# Altium schematic sheet PowerboardV2Sheet2.SchDoc
size A; SheetNumber: 2; SheetTotal: 2
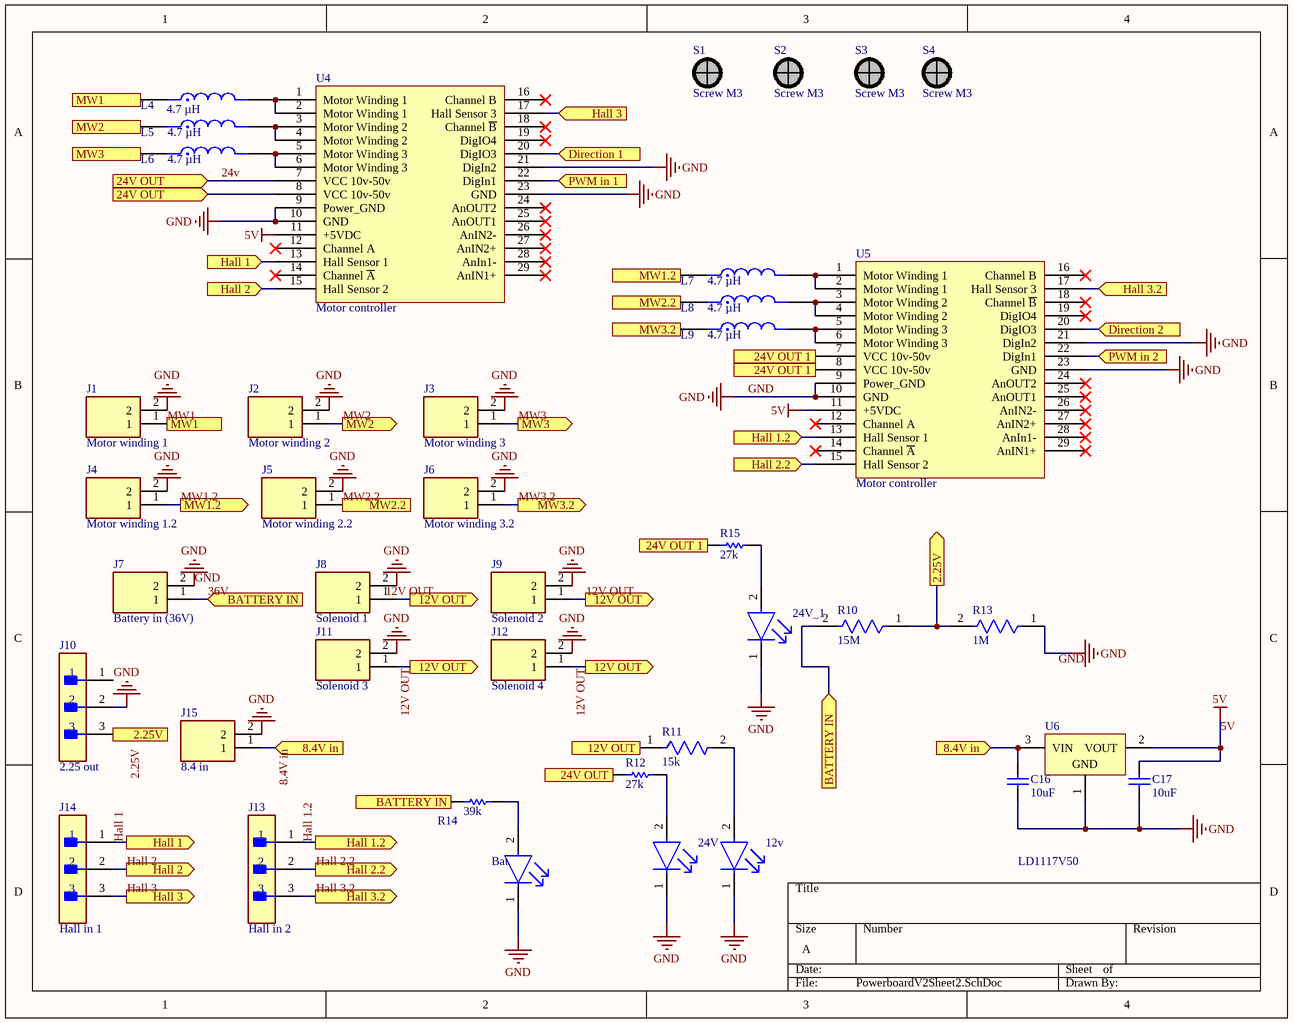
[diagram p0: PowerboardV2Sheet2.SchDoc]

## Parts
12v  LTST-C171GKT  [FP-LTST-C171GKT-MFG]  (value not drawn)
24V  LTST-C171GKT  [FP-LTST-C171GKT-MFG]  (value not drawn)
24V_1  LTST-C171GKT  [FP-LTST-C171GKT-MFG]  (value not drawn)
Bat  LTST-C171GKT  [FP-LTST-C171GKT-MFG]  (value not drawn)
C16  10uF  [CAPC2013X145X48ML20T23]
C17  10uF  [CAPC2013X145X48ML20T23]
J1  Motor winding 1  [19774772]
J2  Motor winding 2  [19774772]
J3  Motor winding 3  [19774772]
J4  Motor winding 1.2  [19774772]
J5  Motor winding 2.2  [19774772]
J6  Motor winding 3.2  [19774772]
J7  Battery in (36V)  [19774772]
J8  Solenoid 1  [19774772]
J9  Solenoid 2  [19774772]
J10  2.25 out  [FP-B3B-XH-A_LF_SN-MFG]
J11  Solenoid 3  [19774772]
J12  Solenoid 4  [19774772]
J13  Hall in 2  [FP-B3B-XH-A_LF_SN-MFG]
J14  Hall in 1  [FP-B3B-XH-A_LF_SN-MFG]
J15  8.4 in  [19774772]
L4  4.7 µH  [WE-TI-LM-STBG]
L5  4.7 µH  [WE-TI-LM-STBG]
L6  4.7 µH  [WE-TI-LM-STBG]
L7  4.7 µH  [WE-TI-LM-STBG]
L8  4.7 µH  [WE-TI-LM-STBG]
L9  4.7 µH  [WE-TI-LM-STBG]
R10  15M  [FP-CRCW0805-e3-IPC_B]
R11  15k  [FP-RN732A-MFG]
R12  27k  [RESC2013X60X40NL20T25]
R13  1M  [FP-CRCW0805-e3-IPC_B]
R14  39k  [RESC2013X60X40LL20T25]
R15  27k  [RESC2013X60X40NL20T25]
S1  Screw M3  [Screw M3]
S2  Screw M3  [Screw M3]
S3  Screw M3  [Screw M3]
S4  Screw M3  [Screw M3]
U4  Motor controller  [PCBComponent_1]
U5  Motor controller  [PCBComponent_1]
U6  LD1117V50  [TO220]

## Ports
2.25V (out, see PowerboardV2Sheet2[1C]), 2.25V (out, see PowerboardV2Sheet2[3C]), 8.4V in (in, see PowerboardV2Sheet2[1C]), 8.4V in (in, see PowerboardV2Sheet2[3C]), 12V OUT (in, see PowerboardV2[4C], PowerboardV2Sheet2[2C]), 12V OUT (out, see PowerboardV2[4C], PowerboardV2Sheet2[2C]), 24V OUT 1 (in, see PowerboardV2[4B], PowerboardV2Sheet2[2C], PowerboardV2Sheet2[3B]), 24V OUT 1 (in, see PowerboardV2[4B], PowerboardV2Sheet2[3B]), 24V OUT (in, see PowerboardV2[4A], PowerboardV2Sheet2[1A]), 24V OUT (in, see PowerboardV2[4A], PowerboardV2Sheet2[1A], PowerboardV2Sheet2[2D]), BATTERY IN (in, see PowerboardV2[1A], PowerboardV2[1B], PowerboardV2[1C], PowerboardV2[1D], PowerboardV2[3B], PowerboardV2[3C], PowerboardV2[3D], PowerboardV2Sheet2[1C], PowerboardV2Sheet2[2D]), BATTERY IN (in, see PowerboardV2[1A], PowerboardV2[1B], PowerboardV2[1C], PowerboardV2[1D], PowerboardV2[3B], PowerboardV2[3C], PowerboardV2[3D], PowerboardV2Sheet2[1C], PowerboardV2Sheet2[3D]), BATTERY IN (in, see PowerboardV2[1A], PowerboardV2[1B], PowerboardV2[1C], PowerboardV2[1D], PowerboardV2[3B], PowerboardV2[3C], PowerboardV2[3D], PowerboardV2Sheet2[2D], PowerboardV2Sheet2[3D]), Direction 1 (in), Direction 2 (in), Hall 1 (in, see PowerboardV2Sheet2[1D]), Hall 1 (out, see PowerboardV2Sheet2[1B]), Hall 1.2 (in, see PowerboardV2Sheet2[1D]), Hall 1.2 (out, see PowerboardV2Sheet2[3B]), Hall 2 (in, see PowerboardV2Sheet2[1D]), Hall 2 (out, see PowerboardV2Sheet2[1B]), Hall 2.2 (in, see PowerboardV2Sheet2[1D]), Hall 2.2 (out, see PowerboardV2Sheet2[3B]), Hall 3 (in, see PowerboardV2Sheet2[1D]), Hall 3 (out, see PowerboardV2Sheet2[2A]), Hall 3.2 (in, see PowerboardV2Sheet2[1D]), Hall 3.2 (out, see PowerboardV2Sheet2[4B]), MW1 (out, see PowerboardV2Sheet2[1A]), MW1 (out, see PowerboardV2Sheet2[1B]), MW1.2 (out, see PowerboardV2Sheet2[1B]), MW1.2 (out, see PowerboardV2Sheet2[2B]), MW2 (out, see PowerboardV2Sheet2[1A]), MW2 (out, see PowerboardV2Sheet2[2B]), MW2.2 (out, see PowerboardV2Sheet2[2B]), MW3 (out, see PowerboardV2Sheet2[1A]), MW3 (out, see PowerboardV2Sheet2[2B]), MW3.2 (out, see PowerboardV2Sheet2[2B]), PWM in 1 (in), PWM in 2 (in)

## Nets
5V: C17.1 U4.11(+5VDC) U5.11(+5VDC) U6.2(VOUT)
GND: 12v.1(C) 24V.1(C) 24V_1.1(C) Bat.1(C) C16.2 C17.2 J1.2 J2.2 J3.2 J4.2 J5.2 J6.2 J7.2 J8.2 J9.2 J10.2 J11.2 J12.2 J15.2 R13.1 U4.9(Power_GND) U4.10(GND) U4.21(DigIn2) U4.23(GND) U5.9(Power_GND) U5.10(GND) U5.21(DigIn2) U5.23(GND) U6.1(GND)
2.25V: J10.3 R10.1 R13.2 ; port 2.25V
8.4V in: C16.1 J15.1 U6.3(VIN) ; port 8.4V in
12V OUT: J8.1 J9.1 J11.1 J12.1 R11.1 ; port 12V OUT
24v: R12.1 U4.7(VCC_10v-50v) U4.8(VCC_10v-50v) ; port 24V OUT
24V OUT 1: R15.1 U5.7(VCC_10v-50v) U5.8(VCC_10v-50v) ; port 24V OUT 1
36V: J7.1 R10.2 R14.1 ; port BATTERY IN
Direction 1: U4.20(DigIO3) ; port Direction 1
Direction 2: U5.20(DigIO3) ; port Direction 2
Hall 1: J14.1 U4.13(Hall_Sensor_1) ; port Hall 1
Hall 1.2: J13.1 U5.13(Hall_Sensor_1) ; port Hall 1.2
Hall 2: J14.2 U4.15(Hall_Sensor_2) ; port Hall 2
Hall 2.2: J13.2 U5.15(Hall_Sensor_2) ; port Hall 2.2
Hall 3: J14.3 U4.17(Hall_Sensor_3) ; port Hall 3
Hall 3.2: J13.3 U5.17(Hall_Sensor_3) ; port Hall 3.2
MW1: J1.1 L4.1 ; port MW1
MW1.2: J4.1 L7.1 ; port MW1.2
MW2: J2.1 L5.1 ; port MW2
MW2.2: J5.1 L8.1 ; port MW2.2
MW3: J3.1 L6.1 ; port MW3
MW3.2: J6.1 L9.1 ; port MW3.2
PWM in 1: U4.22(DigIn1) ; port PWM in 1
PWM in 2: U5.22(DigIn1) ; port PWM in 2
Net12v_2: 12v.2(A) R11.2
Net24V_1_2: 24V_1.2(A) R15.2
Net24V_2: 24V.2(A) R12.2
NetBat_2: Bat.2(A) R14.2
NetL4_2: L4.2 U4.1(Motor_Winding_1) U4.2(Motor_Winding_1)
NetL5_2: L5.2 U4.3(Motor_Winding_2) U4.4(Motor_Winding_2)
NetL6_2: L6.2 U4.5(Motor_Winding_3) U4.6(Motor_Winding_3)
NetL7_2: L7.2 U5.1(Motor_Winding_1) U5.2(Motor_Winding_1)
NetL8_2: L8.2 U5.3(Motor_Winding_2) U5.4(Motor_Winding_2)
NetL9_2: L9.2 U5.5(Motor_Winding_3) U5.6(Motor_Winding_3)

Not connected (* = marked no-connect by the designer): J10 1; U4 12(Channel_A)* 14(Channel_~{A})* 16(Channel_B)* 18(Channel_~{B})* 19(DigIO4)* 24(AnOUT2)* 25(AnOUT1)* 26(AnIN2-)* 27(AnIN2+)* 28(AnIn1-)* 29(AnIN1+)*; U5 12(Channel_A)* 14(Channel_~{A})* 16(Channel_B)* 18(Channel_~{B})* 19(DigIO4)* 24(AnOUT2)* 25(AnOUT1)* 26(AnIN2-)* 27(AnIN2+)* 28(AnIn1-)* 29(AnIN1+)*

## Notes on the sheet
- Labels drawn without touching a wire or pin: 2.25V, GND

## Library data of the parts
12v 24V 24V_1 Bat = CMP-22017-000007-1: LED GREEN CLEAR CHIP SMD; Luminous Intensity: 12mcd; Lens Color: Colorless; Dominant Wavelength: 569nm; Number of LEDs: 1; Power Dissipation: 100mW; Viewing Angle: 130°; Reverse Voltage: 5V; Test Current: 10mA; Forward Voltage: 2.1V; Wavelength: 585nm; Lens Style: Diffused; Forward Current: 30mA; Height: 0.8mm; Mount: Surface Mount; Package Quantity: 1; Length: 2mm; Case Code (Metric): 2012; Number of Pins: 2; Number of Elements: 1; Packaging: Tape and Reel; Color: Green; Min Operating Temperature: -55°C; Case/Package: 0805; Power Rating: 100mW; Max Operating Temperature: 85°C; Radiation Hardening: No; Depth: 1.25mm; Lens Transparency: Clear; Width: 1.25mm; Lead Free: Lead Free; Case Code (Imperial): 0805; Illumination Color: Green
C16 C17 = CMP-2007-03160-1: Part Number: VJ0805Y103KXBBC31; Manufacturer: Vitramon
J1-J9 J11 J12 J15 = 1977477-2: Conn Barrier Strip 2 POS 8.25mm Solder ST Thru-Hole 15A/Contact Carton; MF: TE Connectivity; MP: 1977477-2; DigiKey-Purchase-URL: https://snapeda.com/shop?store=DigiKey&id=598501; SnapEDA_Link: https://www.snapeda.com/parts/1977477-2/TE%20Connectivity%20AMP%20Connectors/view-part/598501/?ref=snap; Availability: Unavailable; Package: None; Value: *; Price: None
J10 J13 J14 = CMP-17439-000014-3: CONN HEADER VERT 3POS 2.5MM; Max Voltage Rating (DC): 250V; Number of Positions: 3; Current Rating: 3A; Gender: Male; Wire/Cable Gauge: 22AWG; Contact Resistance: 20mR; Insulation Resistance: 1GR; Insulation Material: Nylon; Contact Plating: Tin; Depth: 5.75mm; Contact Type: Male Pin; Max Operating Temperature: 85°C; Insulation Color: Natural; Voltage Rating (AC): 250V; Color: Natural; Connector Type: Header; Orientation: Straight; Fastening Type: Detent; Housing Color: White; Min Operating Temperature: -25°C; Termination: Solder; Voltage Rating: 250V; Series: XH; Pitch: 2.5mm; Contact Shape: Square; Number of Rows: 1; Lead Free: Lead Free; Packaging: Bulk; Mount: Through Hole; Flammability Rating: UL94 V-0; Max Voltage Rating (AC): 250V; REACH SVHC: No SVHC; Housing Material: Polyamide; Contact Material: Brass; Lead Pitch: 2.5mm; Contact Finish - Mating: TIN; Length: 9.9mm; Max Current Rating: 3A; Number of Contacts: 3
L4-L9 = 19R472C: Package: None; Price: None; Value: *; MP: 19R472C; Availability: Unavailable
R10 R13 = CMP-2001-03630-2: RES Thick Film, 1MΩ, 1%, 0.125W, 100ppm/°C, 0805; Voltage Rating (DC): 150V; Resistance: 1MR; Power Rating: 125mW; Packaging: Tape and Reel; Case Code (Metric): 2012; Case/Package: 0805; Width: 1.25mm; Mount: Surface Mount; Military Standard: Not; Radiation Hardening: No; Weight: 0.000194oz; Package Quantity: 5000; Max Operating Temperature: 155°C; Contact Plating: Tin; Composition: Thick Film; Number of Pins: 2; Tolerance: 1%; Termination: SMD/SMT; Case Code (Imperial): 0805; Depth: 1.25mm; Temperature Coefficient: 100ppm/°C; Min Operating Temperature: -55°C; Height: 0.45mm; Lead Free: Lead Free; Length: 2mm; Voltage Rating: 150V
R11 = CMP-03211-006689-1: SMD Chip Resistor, Thin Film, 15KΩ, 100 V, 0805 [2012 Metric], 100 mW, 0.1%, RN73 Series RN73C2A15KB; Manufacturer: TE Connectivity; Power Rating: 0.1W; Temperature Coefficient: 10ppm/°C; Voltage Rating: 100V; ComponentLink2URL: https://www.te.com/commerce/DocumentDelivery/DDEController?Action=showdoc&DocId=Data+Sheet%7F1773270%7FP%7Fpdf%7FEnglish%7FENG_DS_1773270_P.pdf%7F1676162-2; octopart_url: https://octopart.com/rn73c2a15kb-te+connectivity-47108263; Temperature: -55°C to 155°C; Temperature Range Low: -55°C; Ipc Land Pattern Name: RESC200125X55; Series: RN73; Package: RN732A; Lead Free: Yes; Device Class L2: Resistors; Resistance: 15KΩ; Octopart: https://octopart.com/rn73c2a15kb-te+connectivity-47108263; RoHS: TRUE; Composition: Thin Film; ComponentLink2Description: Datasheet; Height: 0.65mm; Temperature Range High: 155°C; Category: Res; Automotive: No; packaging: Custom; Tolerance: 0.1%; Device Class L3: Chip SMD Resistors; Device Class L1: Passive Components; Value: 15KΩ; Manufacturer Part Number: RN73C2A15KB
R12 R15 = CMP-2001-00688-1: ERA-6AED273V; Manufacturer: Panasonic; Part Number: ERA-6AED273V
R14 = CMP-2001-00636-1: ERA6AEB393V; Manufacturer: Panasonic; Part Number: ERA6AEB393V
U4 U5 = Component_1
U6 = CMP-0244-00472-1: Fixed Low Drop Positive Voltage Regulator, 5V, 3-Pin TO-220; ComponentLink1URL: http://www.st.com; ComponentLink1Description: Manufacturer URL; DatasheetVersion: 1/11/2011; PackageDescription: TO, Thru-Hole, Vertical, Heatsink Mounted; 3 In-Line Leads; Pitch 2.54 mm; ComponentLink2Description: Datasheet; ComponentLink3URL: http://www.st.com/internet/com/TECHNICAL_RESOURCES/TECHNICAL_LITERATURE/PACKAGE_INFORMATION/CD00004649.pdf; PackageVersion: ver3.0; PackageReference: TO220; ComponentLink2URL: http://www.st.com/internet/com/TECHNICAL_RESOURCES/TECHNICAL_LITERATURE/DATASHEET/CD00000544.pdf; ComponentLink3Description: Package Specification